# Altium project Boris_IO.PrjPCB
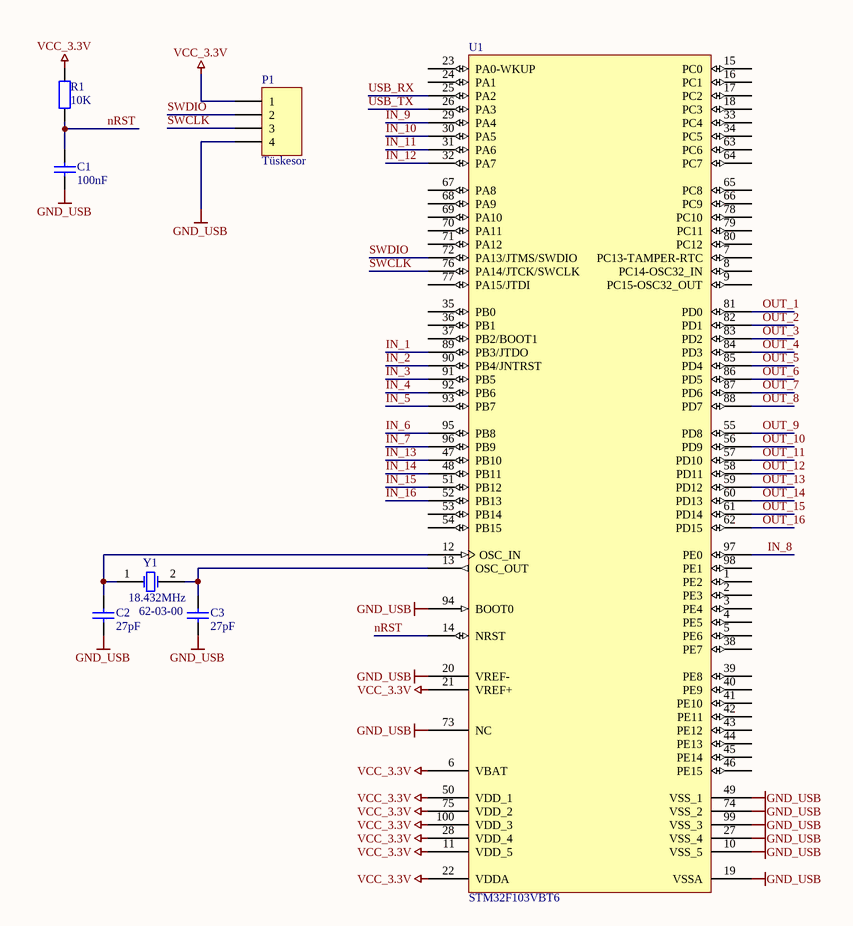
[diagram p0: Boris_IO_1.SchDoc]
5 sheets, 164 parts. Net scope: global (net labels, ports and power ports of the same name join across sheets).
Board file: Boris_IO.PcbDoc
Sheets:
  Boris_IO_1.SchDoc
  Boris_IO_2.SchDoc
  Boris_IO_3.SchDoc
  Boris_IO_4.SchDoc
  Boris_IO_5.SchDoc

## Sheet Boris_IO_1.SchDoc: Boris IO
size A4; Date: 2017.12.10; DrawnBy: Miklós Árpád; Revision: 1.0; SheetNumber: 1; SheetTotal: 5; PageSetup: Record=PageOptions|CenterHorizontal=True|CenterVertical=True|PrintScale=1.00|XCorrection=1.00|YCorrection=1.00|PrintKind=0|BorderSize=5000000|LeftOffset=0|BottomOffset=0|Orientation=2|PaperLength=1000|PaperWidth=1000|Scale=100|PaperSource=7|PrintQuality=-4|MediaType=1|DitherType=10|PaperKind=A4|PrintScaleMode=0; Rule: UNIONINDEX{}0[]RULEKIND{}SupplyNets[]NETSCOPE{}AnyNet[]LAYERKIND{}SameLayer[]NAME{}Schematic Supply Nets[]VOLTAGE{}0,000[]UNIT{}Metric[]PcbType{}ProtelPcb

### Parts
C1  100nF  [0805_CAP]
C2  27pF  [0805_CAP]
C3  27pF  [0805_CAP]
P1  Tüskesor  [HDR1X4_2.54mmp]
R1  10K  [0805_RES]
U1  STM32F103VBT6  [LQFP100_N]
Y1  18.432MHz  Catalog Number: 62-03-00  [SMU4]

### Nets
GND_USB: C1.2 C2.1 C3.1 P1.4 U1.10(VSS_5) U1.19(VSSA) U1.20(VREF-) U1.27(VSS_4) U1.49(VSS_1) U1.73(NC) U1.74(VSS_2) U1.94(BOOT0) U1.99(VSS_3)
VCC_3.3V: P1.1 R1.2 U1.6(VBAT) U1.11(VDD_5) U1.21(VREF+) U1.22(VDDA) U1.28(VDD_4) U1.50(VDD_1) U1.75(VDD_2) U1.100(VDD_3)
IN_1: U1.89(PB3/JTDO)
IN_2: U1.90(PB4/JNTRST)
IN_3: U1.91(PB5)
IN_4: U1.92(PB6)
IN_5: U1.93(PB7)
IN_6: U1.95(PB8)
IN_7: U1.96(PB9)
IN_8: U1.97(PE0)
IN_9: U1.29(PA4)
IN_10: U1.30(PA5)
IN_11: U1.31(PA6)
IN_12: U1.32(PA7)
IN_13: U1.47(PB10)
IN_14: U1.48(PB11)
IN_15: U1.51(PB12)
IN_16: U1.52(PB13)
nRST: C1.1 R1.1 U1.14(NRST)
OUT_1: U1.81(PD0)
OUT_2: U1.82(PD1)
OUT_3: U1.83(PD2)
OUT_4: U1.84(PD3)
OUT_5: U1.85(PD4)
OUT_6: U1.86(PD5)
OUT_7: U1.87(PD6)
OUT_8: U1.88(PD7)
OUT_9: U1.55(PD8)
OUT_10: U1.56(PD9)
OUT_11: U1.57(PD10)
OUT_12: U1.58(PD11)
OUT_13: U1.59(PD12)
OUT_14: U1.60(PD13)
OUT_15: U1.61(PD14)
OUT_16: U1.62(PD15)
SWCLK: P1.3 U1.76(PA14/JTCK/SWCLK)
SWDIO: P1.2 U1.72(PA13/JTMS/SWDIO)
USB_RX: U1.25(PA2)
USB_TX: U1.26(PA3)
NetC2_2: C2.2 U1.12(OSC_IN) Y1.1(OSC1)
NetC3_2: C3.2 U1.13(OSC_OUT) Y1.2(OSC2)

Not connected (* = marked no-connect by the designer): U1 1(PE2) 2(PE3) 3(PE4) 4(PE5) 5(PE6) 7(PC13-TAMPER-RTC) 8(PC14-OSC32_IN) 9(PC15-OSC32_OUT) 15(PC0) 16(PC1) 17(PC2) 18(PC3) 23(PA0-WKUP) 24(PA1) 33(PC4) 34(PC5) 35(PB0) 36(PB1) 37(PB2/BOOT1) 38(PE7) 39(PE8) 40(PE9) 41(PE10) 42(PE11) 43(PE12) 44(PE13) 45(PE14) 46(PE15) 53(PB14) 54(PB15) 63(PC6) 64(PC7) 65(PC8) 66(PC9) 67(PA8) 68(PA9) 69(PA10) 70(PA11) 71(PA12) 77(PA15/JTDI) 78(PC10) 79(PC11) 80(PC12) 98(PE1)

### Notes on the sheet
- Title:
- Date:
- SheetNumber:
- Document Name:
- SheetTotal:
- Revison:
- DrawnBy:
- Size:
- A4

### Library data of the parts
C1-C3 = Cap: Capacitor; Distributor: RET
  C1: Value: 100nF; Catalog Number: 93-04-28; Name: 100nF
  C2 C3: Value: 27pF; Catalog Number: 93-01-45; Name: 27pF
P1 = Header 4: Header, -Pin; Distributor: RET; Name: Tüskesor; Catalog Number: 53-00-04
R1 = Res2: Resistor; Value: 10K; Catalog Number: 92-02-23; Distributor: RET; Name: 10K
U1 = STM32F103VBT6: STM32 ARM-based 32-bit MCU with 64 Kbytes Flash, 100-pin LQFP, Industrial Temperature; Published: 30-May-2008; DatasheetVersion: rev6, Mar-2008; PackageVersion: Mar-2008; PackageReference: LQFP100; Publisher: Altium Limited; PackageDescription: 100-Pin Low-Profile Quad Flat Pack, 14 x 14 mm Body, 0.5 mm Pitch (LQFP100); ComponentLink1Description: Manufacturer Link; ComponentLink1URL: www.st.com/stm32; ComponentLink2Description: Datasheet; ComponentLink2URL: http://www.st.com/stonline/products/literature/ds/13587.pdf
Y1 = XTAL: Crystal Oscillator; Distributor: RET; Name: ="Value" + Crystal; Value: 18.432MHz

## Sheet Boris_IO_2.SchDoc: Boris IO
size A4; Date: 2017.12.10; DrawnBy: Miklós Árpád; Revision: 1.0; SheetNumber: 2; SheetTotal: 5; PageSetup: Record=PageOptions|CenterHorizontal=True|CenterVertical=True|PrintScale=1.00|XCorrection=1.00|YCorrection=1.00|PrintKind=0|BorderSize=5000000|LeftOffset=0|BottomOffset=0|Orientation=2|PaperLength=1000|PaperWidth=1000|Scale=100|PaperSource=7|PrintQuality=-4|MediaType=1|DitherType=10|PaperKind=A4|PrintScaleMode=0
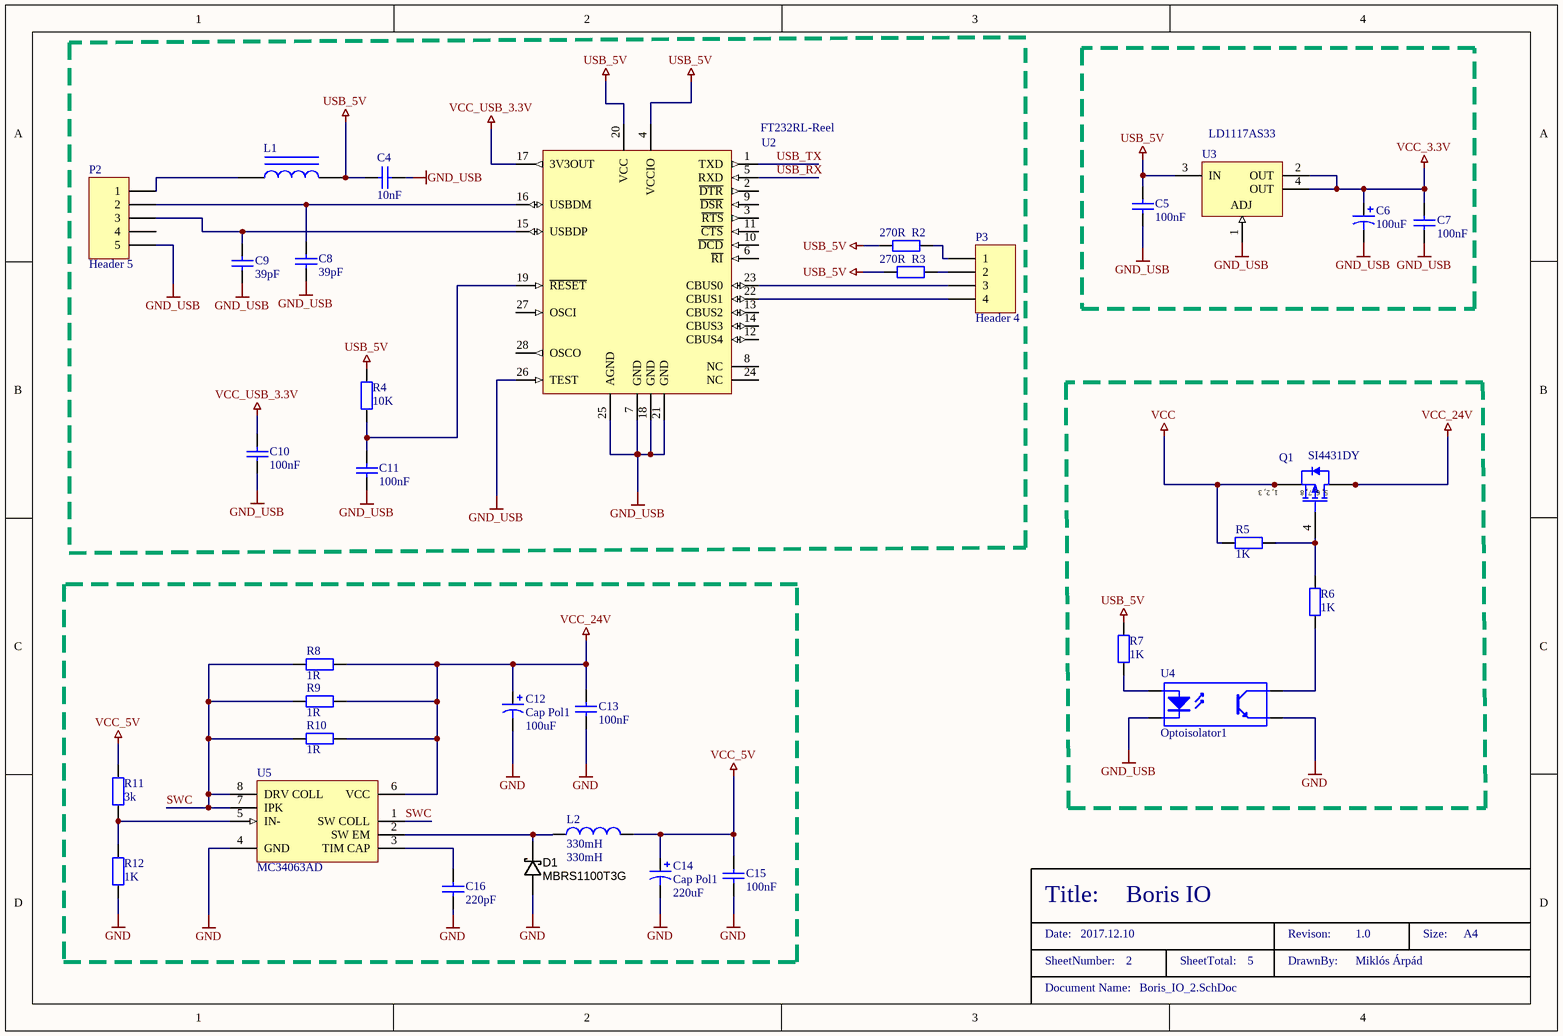
[diagram p1: Boris_IO_2.SchDoc]

### Parts
C4  10nF  [0805_CAP]
C5  100nF  [0805_CAP]
C6  100uF  [7343]
C7  100nF  [0805_CAP]
C8  39pF  [0805_CAP]
C9  39pF  [0805_CAP]
C10  100nF  [0805_CAP]
C11  100nF  [0805_CAP]
C12  Cap Pol1  value 100uF  [CAP_ELEC_SIZE_G]
C13  100nF  [CAPC3216N]
C14  Cap Pol1  value 220uF  [CAP_ELEC_SIZE_E]
C15  100nF  [CAPC3216N]
C16  220pF  [0805_CAP]
D1  MBRS1100T3G  [DO-214AA]
L1  Inductor Iron  [0805_ind]  (value not drawn)
L2  330mH  [IND_Coilcraft_DO3316P_SM]
P2  Header 5  [HDR1X5]
P3  Header 4  [HDR1X4]
Q1  SI4431DY  [SO-8_N]
R2  270R  [0805_RES]
R3  270R  [0805_RES]
R4  10K  [0805_RES]
R5  1K  [RESC3216N]
R6  1K  [RESC3216N]
R7  1K  [RESC3216N]
R8  1R  [RESC3216N]
R9  1R  [RESC3216N]
R10  1R  [RESC3216N]
R11  3k  [RESC3216N]
R12  1K  [RESC3216N]
U2  FT232RL-Reel  [SSOP-28_N]
U3  LD1117AS33  [318E-04]
U4  Optoisolator1  [DIP-4]
U5  MC34063AD  [751-05_N]

### Nets
GND: C12.2 C13.2 C14.2 C15.2 C16.2 D1.A R12.2 U4.3(E) U5.4(GND)
GND_USB: C4.2 C5.2 C6.2 C7.2 C8.1 C9.1 C10.2 C11.2 P2.5 U2.7(GND) U2.18(GND) U2.21(GND) U2.25(AGND) U2.26(TEST) U3.1(ADJ) U4.2(K)
USB_5V: C4.1 C5.1 L1.2 R2.1 R3.1 R4.2 R7.1 U2.4(VCCIO) U2.20(VCC) U3.3(IN)
VCC: Q1.1(S) Q1.2(S) Q1.3(S) R5.1
VCC_3.3V: C6.1 C7.1 U3.2(OUT) U3.4(OUT)
VCC_5V: C14.1 C15.1 L2.2 R11.1
VCC_24V: C12.1 C13.1 Q1.5(D) Q1.6(D) Q1.7(D) Q1.8(D) R8.1 R9.1 R10.1 U5.6(VCC)
VCC_USB_3.3V: C10.1 U2.17(3V3OUT)
SWC: R8.2 R9.2 R10.2 U5.1(SW_COLL) U5.7(IPK) U5.8(DRV_COLL)
USB_RX: U2.5(RXD)
USB_TX: U2.1(TXD)
NetC8_2: C8.2 P2.2 U2.16(USBDM)
NetC9_2: C9.2 P2.3 U2.15(USBDP)
NetC11_1: C11.1 R4.1 U2.19(~{RESET})
NetC16_1: C16.1 U5.3(TIM_CAP)
NetD1_K: D1.K L2.1 U5.2(SW_EM)
NetL1_1: L1.1 P2.1
NetP3_1: P3.1 R2.2
NetP3_2: P3.2 R3.2
NetP3_3: P3.3 U2.23(CBUS0)
NetP3_4: P3.4 U2.22(CBUS1)
NetQ1_4: Q1.4(G) R5.2 R6.1
NetR6_2: R6.2 U4.4(C)
NetR7_2: R7.2 U4.1(A)
NetR11_2: R11.2 R12.1 U5.5(IN-)

Not connected (* = marked no-connect by the designer): P2 4; U2 2(~{DTR}) 3(~{RTS}) 6(~{RI}) 8(NC) 9(~{DSR}) 10(~{DCD}) 11(~{CTS}) 12(CBUS4) 13(CBUS2) 14(CBUS3) 24(NC) 27(OSCI) 28(OSCO)

### Notes on the sheet
- Title:
- Date:
- SheetNumber:
- Document Name:
- SheetTotal:
- Revison:
- DrawnBy:
- Size:
- A4
- (in symbol SI4431DY) 1, 2, 3; 5, 6, 7, 8

### Library data of the parts
C4 C5 C7-C11 C13 C15 C16 = Cap: Capacitor; Distributor: RET
  C4: Value: 10nF; Catalog Number: 93-01-91; Name: 10nF
  C5 C7 C10 C11: Value: 100nF; Catalog Number: 93-04-28; Name: 100nF
  C8 C9: Value: 39pF; Catalog Number: 93-01-93; Name: 39pF
  C13 C15: Value: 100nF; Catalog Number: 93-01-37; Name: 100nF
  C16: Value: 220pF; Catalog Number: 93-00-91; Name: 220pF
C6 C12 C14 = Cap Pol1: Polarized Capacitor (Radial); Distributor: RET
  C6: Value: 100uF; Catalog Number: 93-03-66; Name: 100uF
  C12: Catalog Number: 97-01-16; Name: 100uF
  C14: Catalog Number: 97-00-69; Name: 220uF
D1 = DIODE_SCHOTTKY_MBRS130L: Diode Schottky SMD 30V 1A DO-214AA; Name: MBRS1100T3G; Catalog Number: MBRS1100T3G; Distributor: TME
L1 = Inductor Iron: Magnetic-Core Inductor; Value: 120R; Catalog Number: 77-00-76; Distributor: RET; Name: 120R
L2 = Inductor: Value: 330mH; Catalog Number: 77-00-89; Distributor: RET; Name: 330mH
P2 = Header 5: Header, 5-Pin; LatestRevisionDate: 17-Jul-2002; LatestRevisionNote: Re-released for DXP Platform.; Publisher: Altium Limited
P3 = Header 4: Header, 4-Pin; LatestRevisionDate: 17-Jul-2002; LatestRevisionNote: Re-released for DXP Platform.; Publisher: Altium Limited
Q1 = SI4431DY: P-Channel 30V (D-S)  MOSFET; Published: 8-Jun-2000; LatestRevisionDate: 13-Apr-2006; LatestRevisionNote: IPC-7351 Footprint Added.; DatasheetVersion: 6-Oct-1997; PackageVersion: Aug-1998; PackageReference: SO-8; Publisher: Altium Limited; PackageDescription: 8-Pin Small Outline Integrated Circuit 1.27 mm Pitch; ComponentLink1Description: Manufacturer Link; ComponentLink1URL: http://www.vishay.com/; ComponentLink2Description: Datasheet; ComponentLink2URL: http://www.vishay.com/docs/70151/70151.pdf
R2-R7 R11 R12 = Res2: Resistor; Distributor: RET
  R2 R3: Value: 270R; Catalog Number: 92-00-31; Name: 270R
  R4: Value: 10K; Catalog Number: 92-02-23; Name: 10K
  R5-R7 R12: Value: 1K; Catalog Number: 92-00-38; Name: 1K
  R11: Value: 3k; Catalog Number: 92-01-33; Name: 3k
R8-R10 = Res2: Resistor; Catalog Number: RC1206JR-071RL; Value: 1R; Distributor: TME; Name: 1R
U2 = FT232RL-Reel: USB UART Asynchronous Serial Data Transfer Chip, SSOP-28, Tape and Reel; Catalog Number: FT232RL; Distributor: TME; Name: FT232RL
U3 = LM317MBSTT3: Three-Terminal Adjustable Output Positive Voltage Regulator; Catalog Number: LD1117AS33; Distributor: TME; Name: LD1117AS33
U4 = Optoisolator1: 4-Pin Phototransistor Optocoupler; Published: 24-Mar-1999; LatestRevisionDate: 04-Mar-2005; LatestRevisionNote: Sch pins 3 & 4 Swapped.; DatasheetVersion: Nov-2003; PackageReference: DIP-4; Publisher: Altium Limited
U5 = MC34063AD: DC-to-DC Converter Control Circuit; Catalog Number: MC34063AD; Distributor: TME; Name: MC34063AD

## Sheet Boris_IO_3.SchDoc: Boris IO
size A4; Date: 2017.12.10; DrawnBy: Miklós Árpád; Revision: 1.0; SheetNumber: 3; SheetTotal: 5; PageSetup: Record=PageOptions|CenterHorizontal=True|CenterVertical=True|PrintScale=1.00|XCorrection=1.00|YCorrection=1.00|PrintKind=0|BorderSize=5000000|LeftOffset=0|BottomOffset=0|Orientation=2|PaperLength=1000|PaperWidth=1000|Scale=100|PaperSource=7|PrintQuality=-4|MediaType=1|DitherType=10|PaperKind=A4|PrintScaleMode=0
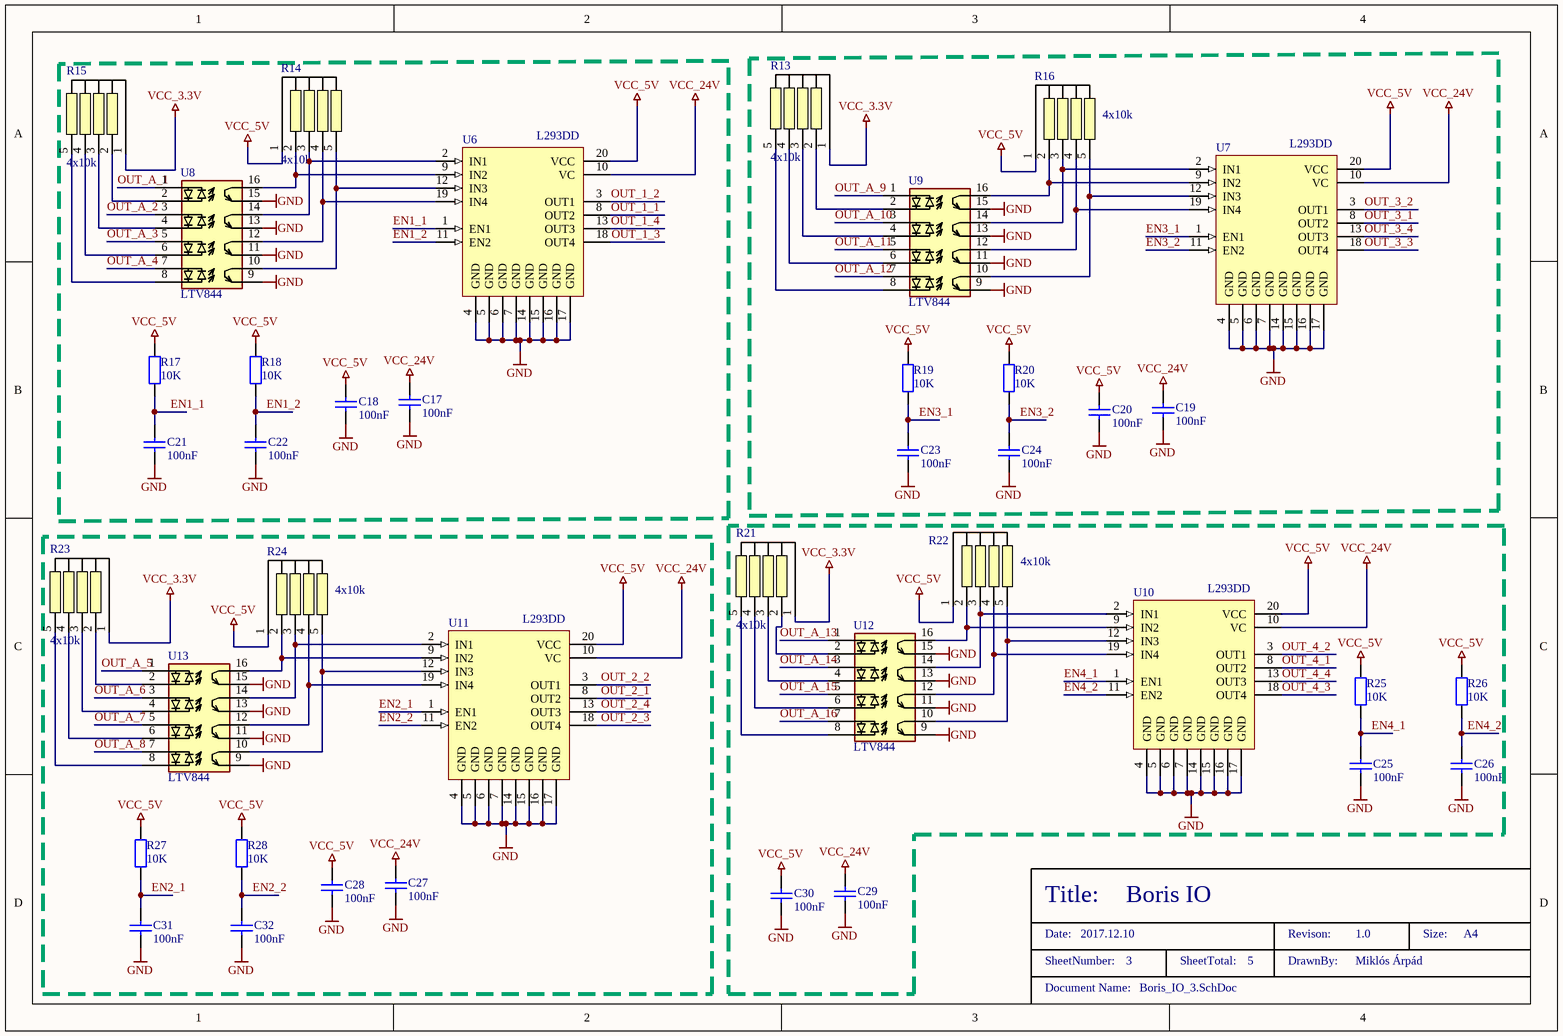
[diagram p2: Boris_IO_3.SchDoc]

### Parts
C17  100nF  [0805_CAP]
C18  100nF  [0805_CAP]
C19  100nF  [0805_CAP]
C20  100nF  [0805_CAP]
C21  100nF  [0805_CAP]
C22  100nF  [0805_CAP]
C23  100nF  [0805_CAP]
C24  100nF  [0805_CAP]
C25  100nF  [0805_CAP]
C26  100nF  [0805_CAP]
C27  100nF  [0805_CAP]
C28  100nF  [0805_CAP]
C29  100nF  [0805_CAP]
C30  100nF  [0805_CAP]
C31  100nF  [0805_CAP]
C32  100nF  [0805_CAP]
R13  4x10k  [NFD_SIL-RES-5]
R14  4x10k  [NFD_SIL-RES-5]
R15  4x10k  [NFD_SIL-RES-5]
R16  4x10k  [NFD_SIL-RES-5]
R17  10K  [0805_RES]
R18  10K  [0805_RES]
R19  10K  [0805_RES]
R20  10K  [0805_RES]
R21  4x10k  [NFD_SIL-RES-5]
R22  4x10k  [NFD_SIL-RES-5]
R23  4x10k  [NFD_SIL-RES-5]
R24  4x10k  [NFD_SIL-RES-5]
R25  10K  [0805_RES]
R26  10K  [0805_RES]
R27  10K  [0805_RES]
R28  10K  [0805_RES]
U6  L293DD  [SO20_N]
U7  L293DD  [SO20_N]
U8  LTV844  [LTV844S]
U9  LTV844  [LTV844S]
U10  L293DD  [SO20_N]
U11  L293DD  [SO20_N]
U12  LTV844  [LTV844S]
U13  LTV844  [LTV844S]

### Nets
GND: C17.2 C18.2 C19.2 C20.2 C21.2 C22.2 C23.2 C24.2 C25.2 C26.2 C27.2 C28.2 C29.2 C30.2 C31.2 C32.2 U6.4(GND) U6.5(GND) U6.6(GND) U6.7(GND) U6.14(GND) U6.15(GND) U6.16(GND) U6.17(GND) U7.4(GND) U7.5(GND) U7.6(GND) U7.7(GND) U7.14(GND) U7.15(GND) U7.16(GND) U7.17(GND) U8.9 U8.11 U8.13 U8.15 U9.9 U9.11 U9.13 U9.15 U10.4(GND) U10.5(GND) U10.6(GND) U10.7(GND) U10.14(GND) U10.15(GND) U10.16(GND) U10.17(GND) U11.4(GND) U11.5(GND) U11.6(GND) U11.7(GND) U11.14(GND) U11.15(GND) U11.16(GND) U11.17(GND) U12.9 U12.11 U12.13 U12.15 U13.9 U13.11 U13.13 U13.15
VCC_3.3V: R13.1 R15.1 R21.1 R23.1
VCC_5V: C18.1 C20.1 C28.1 C30.1 R14.1 R16.1 R17.2 R18.2 R19.2 R20.2 R22.1 R24.1 R25.2 R26.2 R27.2 R28.2 U6.20(VCC) U7.20(VCC) U10.20(VCC) U11.20(VCC)
VCC_24V: C17.1 C19.1 C27.1 C29.1 U6.10(VC) U7.10(VC) U10.10(VC) U11.10(VC)
EN1_1: C21.1 R17.1 U6.1(EN1)
EN1_2: C22.1 R18.1 U6.11(EN2)
EN2_1: C31.1 R27.1 U11.1(EN1)
EN2_2: C32.1 R28.1 U11.11(EN2)
EN3_1: C23.1 R19.1 U7.1(EN1)
EN3_2: C24.1 R20.1 U7.11(EN2)
EN4_1: C25.1 R25.1 U10.1(EN1)
EN4_2: C26.1 R26.1 U10.11(EN2)
OUT_1_1: U6.8(OUT2)
OUT_1_2: U6.3(OUT1)
OUT_1_3: U6.18(OUT4)
OUT_1_4: U6.13(OUT3)
OUT_2_1: U11.8(OUT2)
OUT_2_2: U11.3(OUT1)
OUT_2_3: U11.18(OUT4)
OUT_2_4: U11.13(OUT3)
OUT_3_1: U7.8(OUT2)
OUT_3_2: U7.3(OUT1)
OUT_3_3: U7.18(OUT4)
OUT_3_4: U7.13(OUT3)
OUT_4_1: U10.8(OUT2)
OUT_4_2: U10.3(OUT1)
OUT_4_3: U10.18(OUT4)
OUT_4_4: U10.13(OUT3)
OUT_A_1: U8.1
OUT_A_2: U8.3
OUT_A_3: U8.5
OUT_A_4: U8.7
OUT_A_5: U13.1
OUT_A_6: U13.3
OUT_A_7: U13.5
OUT_A_8: U13.7
OUT_A_9: U9.1
OUT_A_10: U9.3
OUT_A_11: U9.5
OUT_A_12: U9.7
OUT_A_13: U12.1
OUT_A_14: U12.3
OUT_A_15: U12.5
OUT_A_16: U12.7
NetR13_2: R13.2 U9.2
NetR13_3: R13.3 U9.4
NetR13_4: R13.4 U9.6
NetR13_5: R13.5 U9.8
NetR14_2: R14.2 U6.9(IN2) U8.16
NetR14_3: R14.3 U6.2(IN1) U8.14
NetR14_4: R14.4 U6.19(IN4) U8.12
NetR14_5: R14.5 U6.12(IN3) U8.10
NetR15_2: R15.2 U8.2
NetR15_3: R15.3 U8.4
NetR15_4: R15.4 U8.6
NetR15_5: R15.5 U8.8
NetR16_2: R16.2 U7.9(IN2) U9.16
NetR16_3: R16.3 U7.2(IN1) U9.14
NetR16_4: R16.4 U7.19(IN4) U9.12
NetR16_5: R16.5 U7.12(IN3) U9.10
NetR21_2: R21.2 U12.2
NetR21_3: R21.3 U12.4
NetR21_4: R21.4 U12.6
NetR21_5: R21.5 U12.8
NetR22_2: R22.2 U10.9(IN2) U12.16
NetR22_3: R22.3 U10.2(IN1) U12.14
NetR22_4: R22.4 U10.19(IN4) U12.12
NetR22_5: R22.5 U10.12(IN3) U12.10
NetR23_2: R23.2 U13.2
NetR23_3: R23.3 U13.4
NetR23_4: R23.4 U13.6
NetR23_5: R23.5 U13.8
NetR24_2: R24.2 U11.9(IN2) U13.16
NetR24_3: R24.3 U11.2(IN1) U13.14
NetR24_4: R24.4 U11.19(IN4) U13.12
NetR24_5: R24.5 U11.12(IN3) U13.10

### Notes on the sheet
- Title:
- Date:
- SheetNumber:
- Document Name:
- SheetTotal:
- Revison:
- DrawnBy:
- Size:
- A4

### Library data of the parts
C17-C32 = Cap: Capacitor; Value: 100nF; Catalog Number: 93-04-28; Distributor: RET; Name: 100nF
R13-R16 R21-R24 = SIL_10k: RET: *
R17-R20 R25-R28 = Res2: Resistor; Value: 10K; Catalog Number: 92-02-23; Distributor: RET; Name: 10K
U6 U7 U10 U11 = L293DD: Push-Pull Four Channel Driver With Diode; Published: 8-Jun-2000; LatestRevisionDate: 13-Apr-2006; LatestRevisionNote: IPC-7351 Footprint Added.; DatasheetVersion: Jun-1996; PackageVersion: Jul-2001; PackageReference: SO20; Publisher: Altium Limited; PackageDescription: 20-Pin Plastic Small Outline Integrated Circuit 1.27 mm Pitch; Code_JEDEC: MS-013-AC; Code_IPC: SOIC127P1030-20; ComponentLink1Description: Manufacturer Link; ComponentLink1URL: http://www.st.com/; ComponentLink2Description: Datasheet; ComponentLink2URL: http://www.st.com/stonline/products/literature/ds/1330/l293d.pdf
U8 U9 U12 U13 = LTV844: 4x optocoupler

## Sheet Boris_IO_4.SchDoc: Boris IO
size A4; Date: 2017.12.10; DrawnBy: Miklós Árpád; Revision: 1.0; SheetNumber: 4; SheetTotal: 5; PageSetup: Record=PageOptions|CenterHorizontal=True|CenterVertical=True|PrintScale=1.00|XCorrection=1.00|YCorrection=1.00|PrintKind=0|BorderSize=5000000|LeftOffset=0|BottomOffset=0|Orientation=2|PaperLength=1000|PaperWidth=1000|Scale=100|PaperSource=7|PrintQuality=-4|MediaType=1|DitherType=10|PaperKind=A4|PrintScaleMode=0
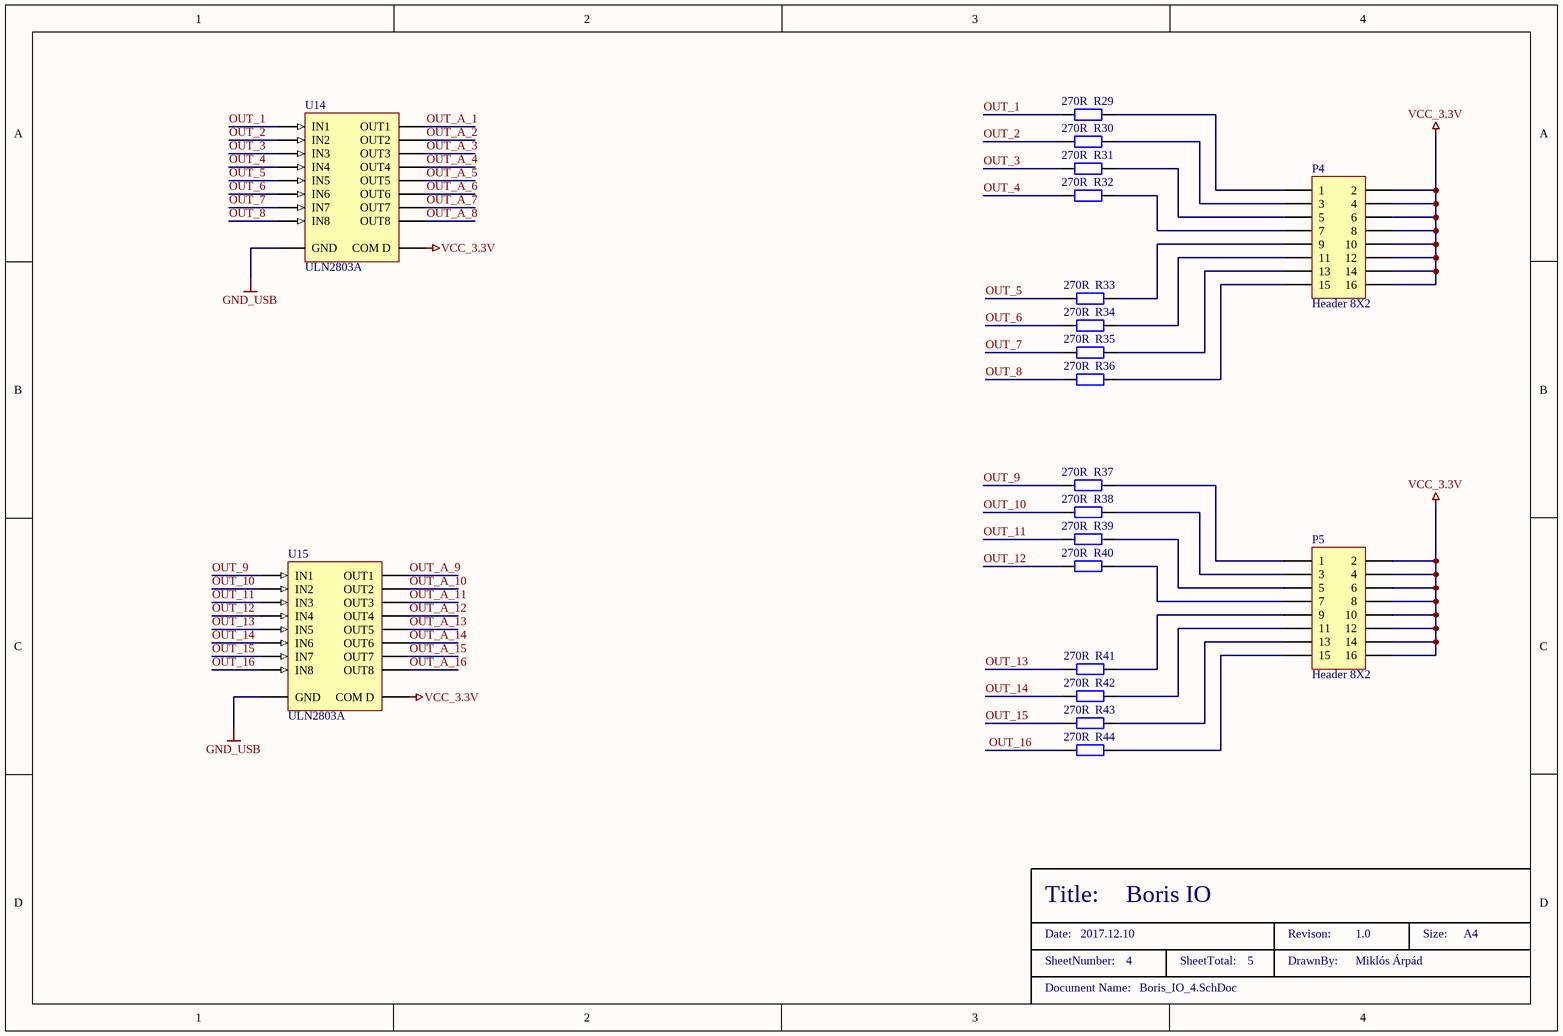
[diagram p3: Boris_IO_4.SchDoc]

### Parts
P4  Header 8X2  [HDR2X8]
P5  Header 8X2  [HDR2X8]
R29  270R  [0805_RES]
R30  270R  [0805_RES]
R31  270R  [0805_RES]
R32  270R  [0805_RES]
R33  270R  [0805_RES]
R34  270R  [0805_RES]
R35  270R  [0805_RES]
R36  270R  [0805_RES]
R37  270R  [0805_RES]
R38  270R  [0805_RES]
R39  270R  [0805_RES]
R40  270R  [0805_RES]
R41  270R  [0805_RES]
R42  270R  [0805_RES]
R43  270R  [0805_RES]
R44  270R  [0805_RES]
U14  ULN2803A  [DIP18]
U15  ULN2803A  [DIP18]

### Nets
GND_USB: U14.9(GND) U15.9(GND)
VCC_3.3V: P4.2 P4.4 P4.6 P4.8 P4.10 P4.12 P4.14 P4.16 P5.2 P5.4 P5.6 P5.8 P5.10 P5.12 P5.14 P5.16 U14.10(COM_D) U15.10(COM_D)
OUT_1: R29.1 U14.1(IN1)
OUT_2: R30.1 U14.2(IN2)
OUT_3: R31.1 U14.3(IN3)
OUT_4: R32.1 U14.4(IN4)
OUT_5: R33.1 U14.5(IN5)
OUT_6: R34.1 U14.6(IN6)
OUT_7: R35.1 U14.7(IN7)
OUT_8: R36.1 U14.8(IN8)
OUT_9: R37.1 U15.1(IN1)
OUT_10: R38.1 U15.2(IN2)
OUT_11: R39.1 U15.3(IN3)
OUT_12: R40.1 U15.4(IN4)
OUT_13: R41.1 U15.5(IN5)
OUT_14: R42.1 U15.6(IN6)
OUT_15: R43.1 U15.7(IN7)
OUT_16: R44.1 U15.8(IN8)
OUT_A_1: U14.18(OUT1)
OUT_A_2: U14.17(OUT2)
OUT_A_3: U14.16(OUT3)
OUT_A_4: U14.15(OUT4)
OUT_A_5: U14.14(OUT5)
OUT_A_6: U14.13(OUT6)
OUT_A_7: U14.12(OUT7)
OUT_A_8: U14.11(OUT8)
OUT_A_9: U15.18(OUT1)
OUT_A_10: U15.17(OUT2)
OUT_A_11: U15.16(OUT3)
OUT_A_12: U15.15(OUT4)
OUT_A_13: U15.14(OUT5)
OUT_A_14: U15.13(OUT6)
OUT_A_15: U15.12(OUT7)
OUT_A_16: U15.11(OUT8)
NetP4_1: P4.1 R29.2
NetP4_3: P4.3 R30.2
NetP4_5: P4.5 R31.2
NetP4_7: P4.7 R32.2
NetP4_9: P4.9 R33.2
NetP4_11: P4.11 R34.2
NetP4_13: P4.13 R35.2
NetP4_15: P4.15 R36.2
NetP5_1: P5.1 R37.2
NetP5_3: P5.3 R38.2
NetP5_5: P5.5 R39.2
NetP5_7: P5.7 R40.2
NetP5_9: P5.9 R41.2
NetP5_11: P5.11 R42.2
NetP5_13: P5.13 R43.2
NetP5_15: P5.15 R44.2

### Notes on the sheet
- Title:
- Date:
- SheetNumber:
- Document Name:
- SheetTotal:
- Revison:
- DrawnBy:
- Size:
- A4

### Library data of the parts
P4 P5 = Header 8X2: Header, 8-Pin, Dual row; LatestRevisionDate: 17-Jul-2002; LatestRevisionNote: Re-released for DXP Platform.; Publisher: Altium Limited
R29-R44 = Res2: Resistor; Value: 270R; Catalog Number: 92-00-31; Distributor: RET; Name: 270R
U14 U15 = ULN2803A: Eight Darlington Array; Published: 8-Jun-2000; LatestRevisionDate: 06-Jun-2005; LatestRevisionNote: Stylized 3D Model Added.; DatasheetVersion: Sep-1997; PackageReference: DIP18; Publisher: Altium Limited; PackageDescription: DIP; 18 Leads; Row Spacing 7.62 mm; Pitch 2.54 mm; ComponentLink1Description: Manufacturer Link; ComponentLink1URL: http://www.st.com/; ComponentLink2Description: Datasheet; ComponentLink2URL: http://www.st.com/stonline/products/literature/ds/1536/uln2801a.pdf

## Sheet Boris_IO_5.SchDoc: Boris IO
size A4; Date: 2017.12.10; DrawnBy: Miklós Árpád; Revision: 1.0; SheetNumber: 5; SheetTotal: 5; PageSetup: Record=PageOptions|CenterHorizontal=True|CenterVertical=True|PrintScale=1.00|XCorrection=1.00|YCorrection=1.00|PrintKind=0|BorderSize=5000000|LeftOffset=0|BottomOffset=0|Orientation=2|PaperLength=1000|PaperWidth=1000|Scale=100|PaperSource=7|PrintQuality=-4|MediaType=1|DitherType=10|PaperKind=A4|PrintScaleMode=0
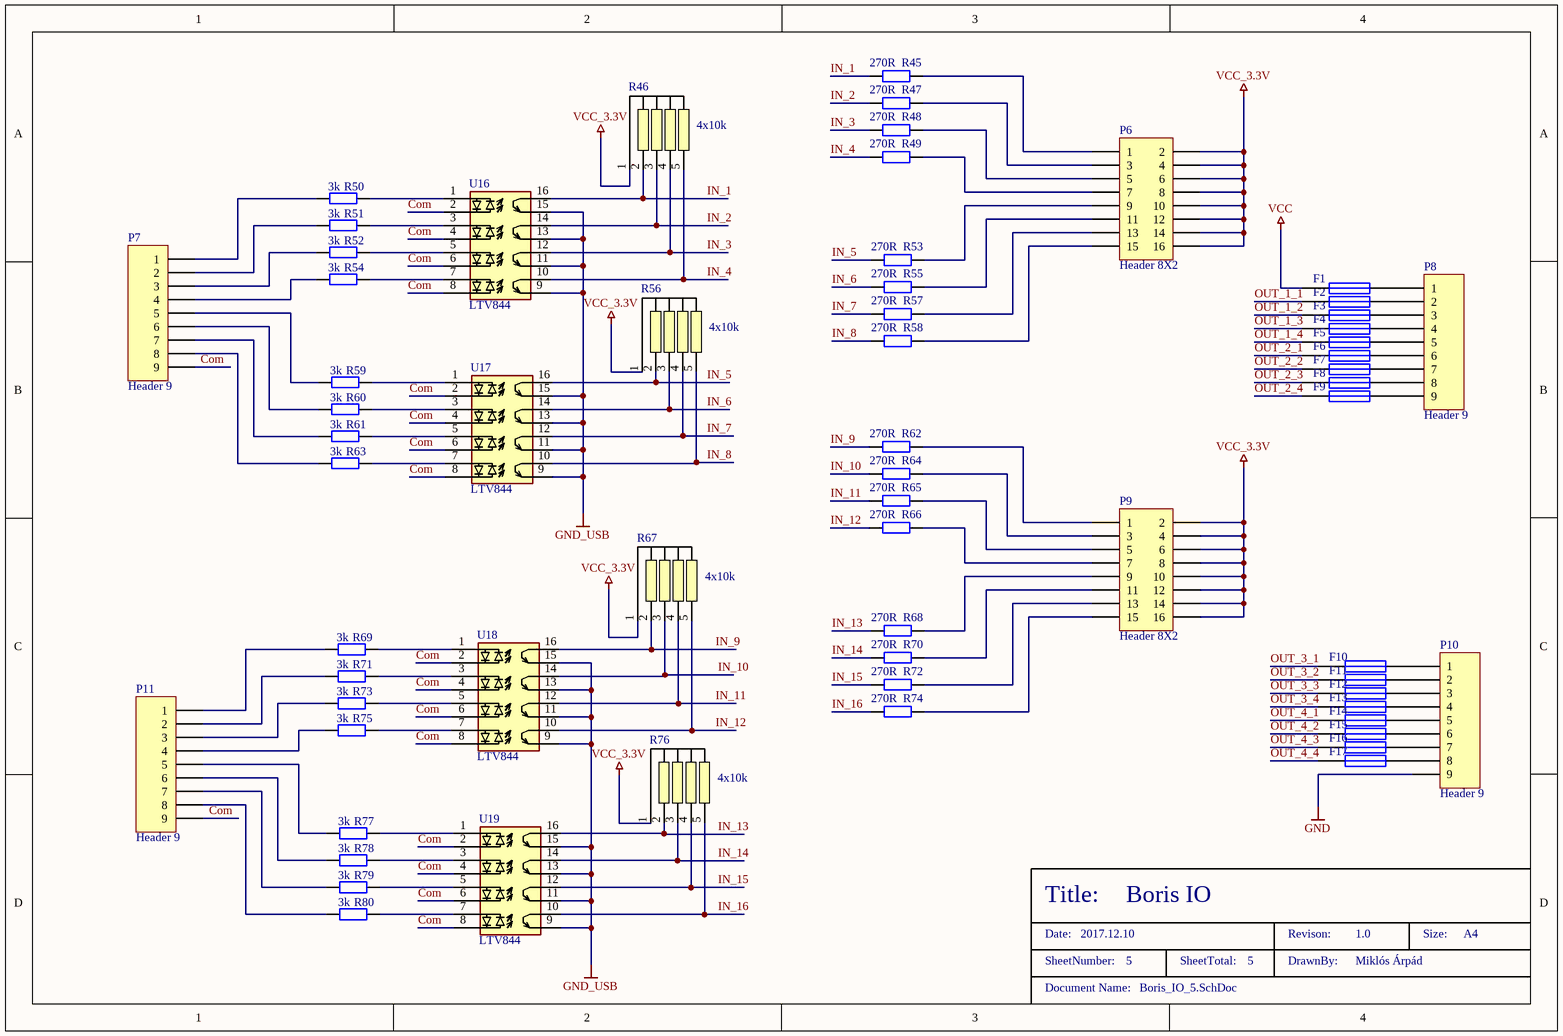
[diagram p4: Boris_IO_5.SchDoc]

### Parts
F1  SSQ 0.25A  [SST6032]  (value not drawn)
F2  SSQ 0.25A  [SST6032]  (value not drawn)
F3  SSQ 0.25A  [SST6032]  (value not drawn)
F4  SSQ 0.25A  [SST6032]  (value not drawn)
F5  SSQ 0.25A  [SST6032]  (value not drawn)
F6  SSQ 0.25A  [SST6032]  (value not drawn)
F7  SSQ 0.25A  [SST6032]  (value not drawn)
F8  SSQ 0.25A  [SST6032]  (value not drawn)
F9  SSQ 0.25A  [SST6032]  (value not drawn)
F10  SSQ 0.25A  [SST6032]  (value not drawn)
F11  SSQ 0.25A  [SST6032]  (value not drawn)
F12  SSQ 0.25A  [SST6032]  (value not drawn)
F13  SSQ 0.25A  [SST6032]  (value not drawn)
F14  SSQ 0.25A  [SST6032]  (value not drawn)
F15  SSQ 0.25A  [SST6032]  (value not drawn)
F16  SSQ 0.25A  [SST6032]  (value not drawn)
F17  SSQ 0.25A  [SST6032]  (value not drawn)
P6  Header 8X2  [HDR2X8]
P7  Header 9  [3x3]
P8  Header 9  [3x3]
P9  Header 8X2  [HDR2X8]
P10  Header 9  [3x3]
P11  Header 9  [3x3]
R45  270R  [0805_RES]
R46  4x10k  [NFD_SIL-RES-5]
R47  270R  [0805_RES]
R48  270R  [0805_RES]
R49  270R  [0805_RES]
R50  3k  [RESC3216N]
R51  3k  [RESC3216N]
R52  3k  [RESC3216N]
R53  270R  [0805_RES]
R54  3k  [RESC3216N]
R55  270R  [0805_RES]
R56  4x10k  [NFD_SIL-RES-5]
R57  270R  [0805_RES]
R58  270R  [0805_RES]
R59  3k  [RESC3216N]
R60  3k  [RESC3216N]
R61  3k  [RESC3216N]
R62  270R  [0805_RES]
R63  3k  [RESC3216N]
R64  270R  [0805_RES]
R65  270R  [0805_RES]
R66  270R  [0805_RES]
R67  4x10k  [NFD_SIL-RES-5]
R68  270R  [0805_RES]
R69  3k  [RESC3216N]
R70  270R  [0805_RES]
R71  3k  [RESC3216N]
R72  270R  [0805_RES]
R73  3k  [RESC3216N]
R74  270R  [0805_RES]
R75  3k  [RESC3216N]
R76  4x10k  [NFD_SIL-RES-5]
R77  3k  [RESC3216N]
R78  3k  [RESC3216N]
R79  3k  [RESC3216N]
R80  3k  [RESC3216N]
U16  LTV844  [LTV844S]
U17  LTV844  [LTV844S]
U18  LTV844  [LTV844S]
U19  LTV844  [LTV844S]

### Nets
GND: P10.9
GND_USB: U16.9 U16.11 U16.13 U16.15 U17.9 U17.11 U17.13 U17.15 U18.9 U18.11 U18.13 U18.15 U19.9 U19.11 U19.13 U19.15
VCC: F1.1
VCC_3.3V: P6.2 P6.4 P6.6 P6.8 P6.10 P6.12 P6.14 P6.16 P9.2 P9.4 P9.6 P9.8 P9.10 P9.12 P9.14 P9.16 R46.1 R56.1 R67.1 R76.1
Com: P7.9 P11.9 U16.2 U16.4 U16.6 U16.8 U17.2 U17.4 U17.6 U17.8 U18.2 U18.4 U18.6 U18.8 U19.2 U19.4 U19.6 U19.8
IN_1: R45.1 R46.2 U16.16
IN_2: R46.3 R47.1 U16.14
IN_3: R46.4 R48.1 U16.12
IN_4: R46.5 R49.1 U16.10
IN_5: R53.1 R56.2 U17.16
IN_6: R55.1 R56.3 U17.14
IN_7: R56.4 R57.1 U17.12
IN_8: R56.5 R58.1 U17.10
IN_9: R62.1 R67.2 U18.16
IN_10: R64.1 R67.3 U18.14
IN_11: R65.1 R67.4 U18.12
IN_12: R66.1 R67.5 U18.10
IN_13: R68.1 R76.2 U19.16
IN_14: R70.1 R76.3 U19.14
IN_15: R72.1 R76.4 U19.12
IN_16: R74.1 R76.5 U19.10
OUT_1_1: F2.1
OUT_1_2: F3.1
OUT_1_3: F4.1
OUT_1_4: F5.1
OUT_2_1: F6.1
OUT_2_2: F7.1
OUT_2_3: F8.1
OUT_2_4: F9.1
OUT_3_1: F10.1
OUT_3_2: F11.1
OUT_3_3: F12.1
OUT_3_4: F13.1
OUT_4_1: F14.1
OUT_4_2: F15.1
OUT_4_3: F16.1
OUT_4_4: F17.1
NetF1_2: F1.2 P8.1
NetF2_2: F2.2 P8.2
NetF3_2: F3.2 P8.3
NetF4_2: F4.2 P8.4
NetF5_2: F5.2 P8.5
NetF6_2: F6.2 P8.6
NetF7_2: F7.2 P8.7
NetF8_2: F8.2 P8.8
NetF9_2: F9.2 P8.9
NetF10_2: F10.2 P10.1
NetF11_2: F11.2 P10.2
NetF12_2: F12.2 P10.3
NetF13_2: F13.2 P10.4
NetF14_2: F14.2 P10.5
NetF15_2: F15.2 P10.6
NetF16_2: F16.2 P10.7
NetF17_2: F17.2 P10.8
NetP6_1: P6.1 R45.2
NetP6_3: P6.3 R47.2
NetP6_5: P6.5 R48.2
NetP6_7: P6.7 R49.2
NetP6_9: P6.9 R53.2
NetP6_11: P6.11 R55.2
NetP6_13: P6.13 R57.2
NetP6_15: P6.15 R58.2
NetP7_1: P7.1 R50.1
NetP7_2: P7.2 R51.1
NetP7_3: P7.3 R52.1
NetP7_4: P7.4 R54.1
NetP7_5: P7.5 R59.1
NetP7_6: P7.6 R60.1
NetP7_7: P7.7 R61.1
NetP7_8: P7.8 R63.1
NetP9_1: P9.1 R62.2
NetP9_3: P9.3 R64.2
NetP9_5: P9.5 R65.2
NetP9_7: P9.7 R66.2
NetP9_9: P9.9 R68.2
NetP9_11: P9.11 R70.2
NetP9_13: P9.13 R72.2
NetP9_15: P9.15 R74.2
NetP11_1: P11.1 R69.1
NetP11_2: P11.2 R71.1
NetP11_3: P11.3 R73.1
NetP11_4: P11.4 R75.1
NetP11_5: P11.5 R77.1
NetP11_6: P11.6 R78.1
NetP11_7: P11.7 R79.1
NetP11_8: P11.8 R80.1
NetR50_2: R50.2 U16.1
NetR51_2: R51.2 U16.3
NetR52_2: R52.2 U16.5
NetR54_2: R54.2 U16.7
NetR59_2: R59.2 U17.1
NetR60_2: R60.2 U17.3
NetR61_2: R61.2 U17.5
NetR63_2: R63.2 U17.7
NetR69_2: R69.2 U18.1
NetR71_2: R71.2 U18.3
NetR73_2: R73.2 U18.5
NetR75_2: R75.2 U18.7
NetR77_2: R77.2 U19.1
NetR78_2: R78.2 U19.3
NetR79_2: R79.2 U19.5
NetR80_2: R80.2 U19.7

### Notes on the sheet
- Title:
- Date:
- SheetNumber:
- Document Name:
- SheetTotal:
- Revison:
- DrawnBy:
- Size:
- A4

### Library data of the parts
F1-F17 = Fuse 1: Fuse; Published: 8-Jun-2000; LatestRevisionDate: 17-Jul-2002; LatestRevisionNote: Re-released for DXP Platform.; PackageReference: PIN-W2/E2.8; Publisher: Altium Limited; PackageDescription: Thru-Hole; 2 Leads; RET: 54-02-04
P6 P9 = Header 8X2: Header, 8-Pin, Dual row; LatestRevisionDate: 17-Jul-2002; LatestRevisionNote: Re-released for DXP Platform.; Publisher: Altium Limited
P7 P8 P10 P11 = Header 9: Header, 9-Pin; LatestRevisionDate: 17-Jul-2002; LatestRevisionNote: Re-released for DXP Platform.; Publisher: Altium Limited
R45 R47-R55 R57-R66 R68-R75 R77-R80 = Res2: Resistor; Distributor: RET
  R45 R47-R49 R53 R55 R57 R58 R62 R64-R66 R68 R70 R72 R74: Value: 270R; Catalog Number: 92-00-31; Name: 270R
  R50-R52 R54 R59-R61 R63 R69 R71 R73 R75 R77-R80: Value: 3k; Catalog Number: 92-01-33; Name: 3k
R46 R56 R67 R76 = SIL_10k: RET: *
U16-U19 = LTV844: 4x optocoupler

## Nets that join several sheets
GND: Boris_IO_2 (9 pins), Boris_IO_3 (64 pins), Boris_IO_5 (P10.9)
GND_USB: Boris_IO_1 (13 pins), Boris_IO_2 (16 pins), Boris_IO_4 (U14.9 U15.9), Boris_IO_5 (16 pins)
VCC: Boris_IO_2 (Q1.1 Q1.2 Q1.3 R5.1), Boris_IO_5 (F1.1)
VCC_3.3V: Boris_IO_1 (10 pins), Boris_IO_2 (C6.1 C7.1 U3.2 U3.4), Boris_IO_3 (R13.1 R15.1 R21.1 R23.1), Boris_IO_4 (18 pins), Boris_IO_5 (20 pins)
VCC_5V: Boris_IO_2 (C14.1 C15.1 L2.2 R11.1), Boris_IO_3 (20 pins)
VCC_24V: Boris_IO_2 (10 pins), Boris_IO_3 (8 pins)
IN_1: Boris_IO_1 (U1.89), Boris_IO_5 (R45.1 R46.2 U16.16)
IN_2: Boris_IO_1 (U1.90), Boris_IO_5 (R46.3 R47.1 U16.14)
IN_3: Boris_IO_1 (U1.91), Boris_IO_5 (R46.4 R48.1 U16.12)
IN_4: Boris_IO_1 (U1.92), Boris_IO_5 (R46.5 R49.1 U16.10)
IN_5: Boris_IO_1 (U1.93), Boris_IO_5 (R53.1 R56.2 U17.16)
IN_6: Boris_IO_1 (U1.95), Boris_IO_5 (R55.1 R56.3 U17.14)
IN_7: Boris_IO_1 (U1.96), Boris_IO_5 (R56.4 R57.1 U17.12)
IN_8: Boris_IO_1 (U1.97), Boris_IO_5 (R56.5 R58.1 U17.10)
IN_9: Boris_IO_1 (U1.29), Boris_IO_5 (R62.1 R67.2 U18.16)
IN_10: Boris_IO_1 (U1.30), Boris_IO_5 (R64.1 R67.3 U18.14)
IN_11: Boris_IO_1 (U1.31), Boris_IO_5 (R65.1 R67.4 U18.12)
IN_12: Boris_IO_1 (U1.32), Boris_IO_5 (R66.1 R67.5 U18.10)
IN_13: Boris_IO_1 (U1.47), Boris_IO_5 (R68.1 R76.2 U19.16)
IN_14: Boris_IO_1 (U1.48), Boris_IO_5 (R70.1 R76.3 U19.14)
IN_15: Boris_IO_1 (U1.51), Boris_IO_5 (R72.1 R76.4 U19.12)
IN_16: Boris_IO_1 (U1.52), Boris_IO_5 (R74.1 R76.5 U19.10)
OUT_1: Boris_IO_1 (U1.81), Boris_IO_4 (R29.1 U14.1)
OUT_1_1: Boris_IO_3 (U6.8), Boris_IO_5 (F2.1)
OUT_1_2: Boris_IO_3 (U6.3), Boris_IO_5 (F3.1)
OUT_1_3: Boris_IO_3 (U6.18), Boris_IO_5 (F4.1)
OUT_1_4: Boris_IO_3 (U6.13), Boris_IO_5 (F5.1)
OUT_2: Boris_IO_1 (U1.82), Boris_IO_4 (R30.1 U14.2)
OUT_2_1: Boris_IO_3 (U11.8), Boris_IO_5 (F6.1)
OUT_2_2: Boris_IO_3 (U11.3), Boris_IO_5 (F7.1)
OUT_2_3: Boris_IO_3 (U11.18), Boris_IO_5 (F8.1)
OUT_2_4: Boris_IO_3 (U11.13), Boris_IO_5 (F9.1)
OUT_3: Boris_IO_1 (U1.83), Boris_IO_4 (R31.1 U14.3)
OUT_3_1: Boris_IO_3 (U7.8), Boris_IO_5 (F10.1)
OUT_3_2: Boris_IO_3 (U7.3), Boris_IO_5 (F11.1)
OUT_3_3: Boris_IO_3 (U7.18), Boris_IO_5 (F12.1)
OUT_3_4: Boris_IO_3 (U7.13), Boris_IO_5 (F13.1)
OUT_4: Boris_IO_1 (U1.84), Boris_IO_4 (R32.1 U14.4)
OUT_4_1: Boris_IO_3 (U10.8), Boris_IO_5 (F14.1)
OUT_4_2: Boris_IO_3 (U10.3), Boris_IO_5 (F15.1)
OUT_4_3: Boris_IO_3 (U10.18), Boris_IO_5 (F16.1)
OUT_4_4: Boris_IO_3 (U10.13), Boris_IO_5 (F17.1)
OUT_5: Boris_IO_1 (U1.85), Boris_IO_4 (R33.1 U14.5)
OUT_6: Boris_IO_1 (U1.86), Boris_IO_4 (R34.1 U14.6)
OUT_7: Boris_IO_1 (U1.87), Boris_IO_4 (R35.1 U14.7)
OUT_8: Boris_IO_1 (U1.88), Boris_IO_4 (R36.1 U14.8)
OUT_9: Boris_IO_1 (U1.55), Boris_IO_4 (R37.1 U15.1)
OUT_10: Boris_IO_1 (U1.56), Boris_IO_4 (R38.1 U15.2)
OUT_11: Boris_IO_1 (U1.57), Boris_IO_4 (R39.1 U15.3)
OUT_12: Boris_IO_1 (U1.58), Boris_IO_4 (R40.1 U15.4)
OUT_13: Boris_IO_1 (U1.59), Boris_IO_4 (R41.1 U15.5)
OUT_14: Boris_IO_1 (U1.60), Boris_IO_4 (R42.1 U15.6)
OUT_15: Boris_IO_1 (U1.61), Boris_IO_4 (R43.1 U15.7)
OUT_16: Boris_IO_1 (U1.62), Boris_IO_4 (R44.1 U15.8)
OUT_A_1: Boris_IO_3 (U8.1), Boris_IO_4 (U14.18)
OUT_A_2: Boris_IO_3 (U8.3), Boris_IO_4 (U14.17)
OUT_A_3: Boris_IO_3 (U8.5), Boris_IO_4 (U14.16)
OUT_A_4: Boris_IO_3 (U8.7), Boris_IO_4 (U14.15)
OUT_A_5: Boris_IO_3 (U13.1), Boris_IO_4 (U14.14)
OUT_A_6: Boris_IO_3 (U13.3), Boris_IO_4 (U14.13)
OUT_A_7: Boris_IO_3 (U13.5), Boris_IO_4 (U14.12)
OUT_A_8: Boris_IO_3 (U13.7), Boris_IO_4 (U14.11)
OUT_A_9: Boris_IO_3 (U9.1), Boris_IO_4 (U15.18)
OUT_A_10: Boris_IO_3 (U9.3), Boris_IO_4 (U15.17)
OUT_A_11: Boris_IO_3 (U9.5), Boris_IO_4 (U15.16)
OUT_A_12: Boris_IO_3 (U9.7), Boris_IO_4 (U15.15)
OUT_A_13: Boris_IO_3 (U12.1), Boris_IO_4 (U15.14)
OUT_A_14: Boris_IO_3 (U12.3), Boris_IO_4 (U15.13)
OUT_A_15: Boris_IO_3 (U12.5), Boris_IO_4 (U15.12)
OUT_A_16: Boris_IO_3 (U12.7), Boris_IO_4 (U15.11)
USB_RX: Boris_IO_1 (U1.25), Boris_IO_2 (U2.5)
USB_TX: Boris_IO_1 (U1.26), Boris_IO_2 (U2.1)